# Altium schematic sheet OMODRI_Support.SchDoc
size A3; Date: Not shown in title block; ApprovedBy: Not shown in title block; CheckedBy: Not shown in title block; Author: Not shown in title block; CompanyName: Not shown in title block; DrawnBy: Cody Watkins; Engineer: Not shown in title block; Organization: Not shown in title block; Address1: Not shown in title block; Address2: Not shown in title block; Address3: Not shown in title block; Address4: Not shown in title block; DocumentNumber: 3; Revision: Use project parameter SCH_Rev; SheetNumber: 3; SheetTotal: 11; PageSetup: Record=PageOptions|CenterHorizontal=True|CenterVertical=True|PrintScale=1.00|XCorrection=1.00|YCorrection=1.00|PrintKind=0|BorderSize=5000000|LeftOffset=0|BottomOffset=0|Orientation=2|PaperLength=1000|PaperWidth=1000|Scale=100|PaperSource=15|PrintQuality=600|MediaType=1|DitherType=10|PaperKind=Letter|PrintScaleMode=1; CurrentTime: Not shown in title block; CurrentDate: Not shown in title block; Time: Not shown in title block; DocumentFullPathAndName: Not shown in title block; DocumentName: Not shown in title block; ModifiedDate: Not shown in title block; ImagePath: Not shown in title block
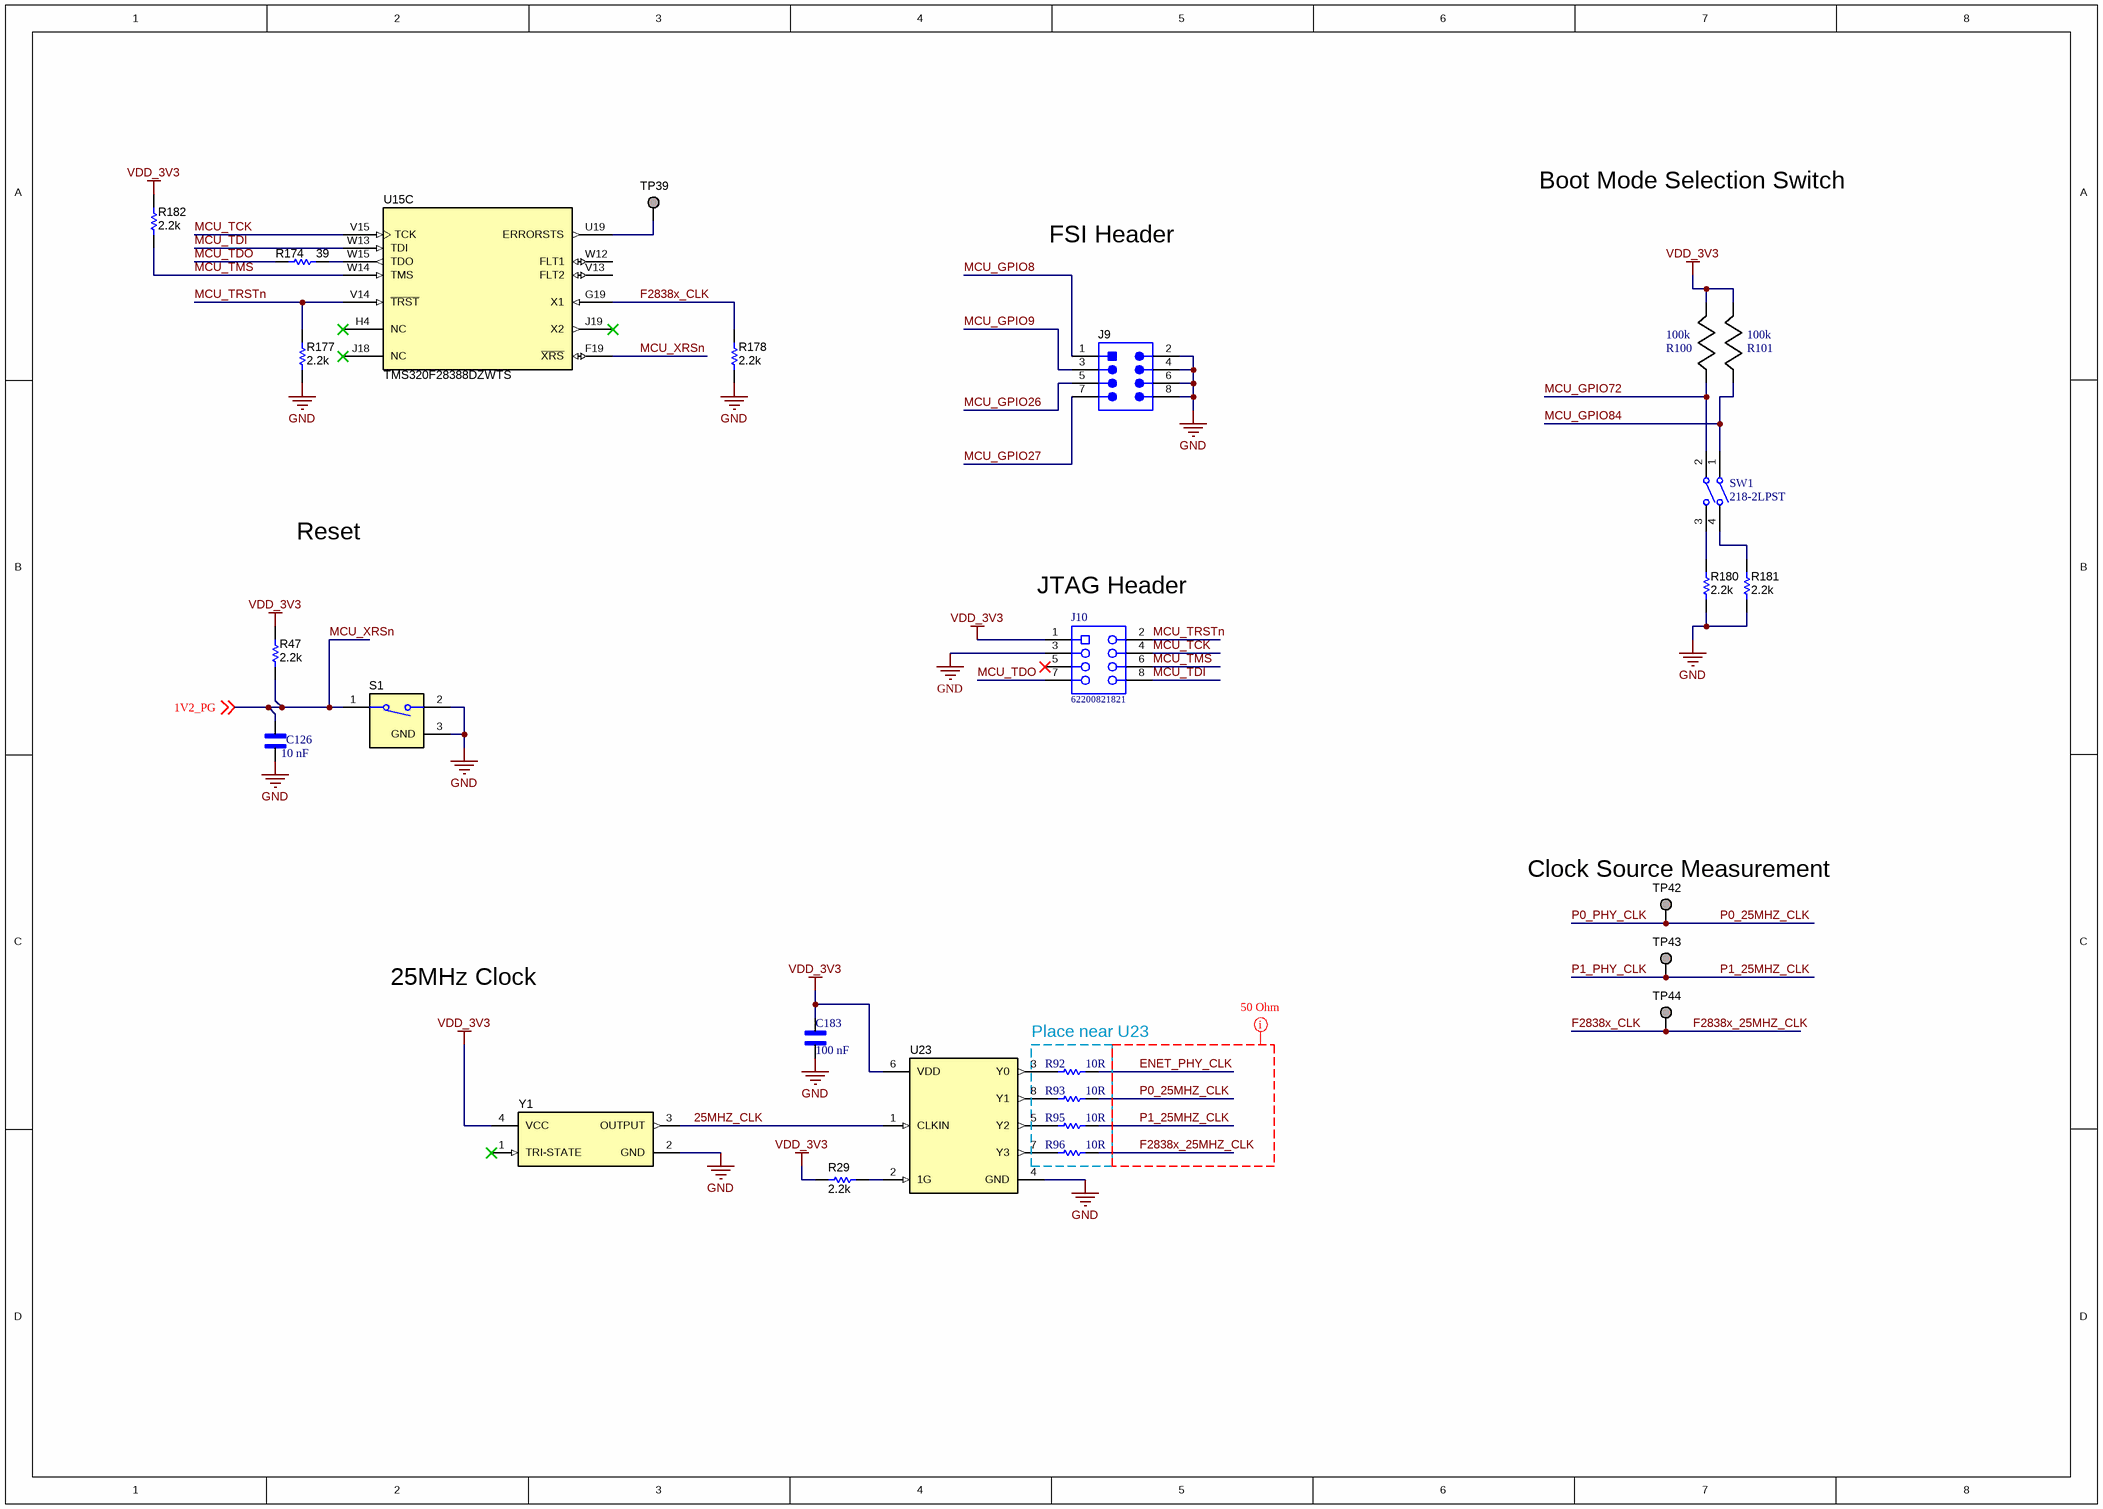
[diagram p0: OMODRI_Support.SchDoc]

## Parts
C126  value 10 nF  [CAPC0603X33N]  (hidden comment: GRM033R71E103KE14D)
C183  value 100 nF  [CAPC0603X33N]  (hidden comment: GRM033R61E104KE14D)
J9  TMM-104-01-T-D  [Samtec_TMM-104-01-x-D]  (value not drawn)
J10  62200821821  [62200821821]
R29  ValueDisplayed: 2.2k  [0402]  (hidden comment: CRCW04022K20JNED)
R47  ValueDisplayed: 2.2k  [0402]  (hidden comment: CRCW04022K20JNED)
R92  Resistance: 10R  [RESC1005X40X25ML05T10]  (hidden comment: CRCW040210R0FKEDHP)
R93  Resistance: 10R  [RESC1005X40X25ML05T10]  (hidden comment: CRCW040210R0FKEDHP)
R95  Resistance: 10R  [RESC1005X40X25ML05T10]  (hidden comment: CRCW040210R0FKEDHP)
R96  Resistance: 10R  [RESC1005X40X25ML05T10]  (hidden comment: CRCW040210R0FKEDHP)
R100  Resistance: 100k  [0402]  (hidden comment: CRCW0402100KFKED)
R101  Resistance: 100k  [0402]  (hidden comment: CRCW0402100KFKED)
R174  ValueDisplayed: 39  [0402]  (hidden comment: CRCW040239R0JNED)
R177  ValueDisplayed: 2.2k  [0402]  (hidden comment: CRCW04022K20JNED)
R178  ValueDisplayed: 2.2k  [0402]  (hidden comment: CRCW04022K20JNED)
R180  ValueDisplayed: 2.2k  [0402]  (hidden comment: CRCW04022K20JNED)
R181  ValueDisplayed: 2.2k  [0402]  (hidden comment: CRCW04022K20JNED)
R182  ValueDisplayed: 2.2k  [0402]  (hidden comment: CRCW04022K20JNED)
S1  B3U-1100P  [SW_B3U-1100P]  (value not drawn)
SW1  218-2LPST  [CTS-218-2LPST_V]
TP39  TESTPOINT  [TP_50MIL-25MILHOLE]  (value not drawn)  (no BOM)
TP42  TESTPOINT  [TP_50MIL-25MILHOLE]  (value not drawn)  (no BOM)
TP43  TESTPOINT  [TP_50MIL-25MILHOLE]  (value not drawn)  (no BOM)
TP44  TESTPOINT  [TP_50MIL-25MILHOLE]  (value not drawn)  (no BOM)
U15  TMS320F28388DZWTS  [ZWT0337A]  (part C of 5)
U23  CDCLVC1104PW  [PW0008A_N]  (value not drawn)
Y1  ECS-2520S33-250-FN-TR  [ECS_ECS-2520S]  (value not drawn)

## Nets
GND: C126.1 C183.2 J9.2 J9.4 J9.6 J9.8 J10.3 R177.1 R178.1 R180.2 R181.1 S1.2 S1.3(GND) U23.4(GND) Y1.2(GND)
VDD_3V3: C183.1 J10.1 R29.2 R47.2 R100.1 R101.1 R182.2 U23.6(VDD) Y1.4(VCC)
25MHZ_CLK: U23.1(CLKIN) Y1.3(OUTPUT)
ENET_PHY_CLK: R92.2
F2838x_25MHZ_CLK: R96.2 R178.2 TP44.1 U15.G19(X1)  [also labelled F2838x_CLK]
MCU_GPIO8: J9.1
MCU_GPIO9: J9.3
MCU_GPIO26: J9.5
MCU_GPIO27: J9.7
MCU_GPIO72: R100.2 SW1.2
MCU_GPIO84: R101.2 SW1.1
MCU_TCK: J10.4 U15.V15(TCK)
MCU_TDI: J10.8 U15.W13(TDI)
MCU_TDO: J10.7 R174.1
MCU_TMS: J10.6 R182.1 U15.W14(TMS)
MCU_TRSTn: J10.2 R177.2 U15.V14(~{TRST})
MCU_XRSn: C126.2 R47.1 S1.1 U15.F19(~{XRS}) ; off-sheet 1V2_PG  [also labelled 1V2_PG]
P0_25MHZ_CLK: R93.2 TP42.1  [also labelled P0_PHY_CLK]
P1_25MHZ_CLK: R95.2 TP43.1  [also labelled P1_PHY_CLK]
NetR29_1: R29.1 U23.2(1G)
NetR92_1: R92.1 U23.3(Y0)
NetR93_1: R93.1 U23.8(Y1)
NetR95_1: R95.1 U23.5(Y2)
NetR96_1: R96.1 U23.7(Y3)
NetR174_2: R174.2 U15.W15(TDO)
NetR180_1: R180.1 SW1.3
NetR181_2: R181.2 SW1.4
NetTP39_1: TP39.1 U15.U19(ERRORSTS)

Not connected (* = marked no-connect by the designer): J10 5*; U15 H4(NC)* J18(NC)* J19(X2)* V13(FLT2) W12(FLT1); Y1 1(TRI-STATE)*

## Layout directives
50 Ohm Impedance: Undefined: ENET_PHY_CLK, F2838x_25MHZ_CLK, P0_25MHZ_CLK, P1_25MHZ_CLK

## Notes on the sheet
- Boot Mode Selection Switch
- FSI Header
- Reset
- (near J10) JTAG Header
- (near TP42) Clock Source Measurement
- 25MHz Clock
- Place near U23
- Drawn By:
- SVN Rev:
- Number:
- TID #:
- Orderable:
- Rev:
- Sheet Title:
- File:
- Project Title:
- Designed for:
- Assembly Variant:
- Mod. Date:
- Sheet:
- Size:
- of
- B
- http://www.ti.com
- Texas Instruments and/or its licensors do not warrant the accuracy or completeness of this specification or any information contained therein. Texas Instruments and/or its licensors do not warrant that this design will meet the specifications, will be suitable for your application or fit for any particular purpose, or will operate in an implementation. Texas Instruments and/or its licensors do not warrant that the design is production worthy. You should completely validate and test your design implementation to confirm the system functionality for your application.
- Engineer:
- Contact:
- © Texas Instruments

## Library data of the parts
C126 = GRM033R71E103KE14D: SMD Capacitor X7R_EIA_ with Capacitance: 10000pF Tol. 10%. Rated Voltage: 25Vdc; MF: Murata; SnapEDA_Link: https://www.snapeda.com/parts/GRM033R71E103KE14D/Murata/view-part/4379447/?ref=snap; Package: 0603 Taiyo Yuden; MP: GRM033R71E103KE14D; Digi-Key_Purchase_URL: https://www.digikey.com/product-detail/en/murata-electronics/GRM033R71E103KE14D/490-14454-1-ND/6606915?utm_source=snapeda&utm_medium=aggregator&utm_campaign=symbol; Digi-Key_Part_Number: 490-14454-1-ND
C183 = GRM033R61E104KE14D: SMD Capacitor X5R_EIA_ with Capacitance: 0.10uF Tol. 10%. Rated Voltage: 25Vdc; MF: Murata; SnapEDA_Link: https://www.snapeda.com/parts/GRM033R61E104KE14D/Murata/view-part/4375622/?ref=snap; Availability: Unavailable; MP: GRM033R61E104KE14D; Package: 0603 Taiyo Yuden; Price: None
J9 = CMP-0055568-2: Header, 2mm, 4x2, Tin, TH; Manufacturer: Samtec; Current_A: 3.2A; Shrouded: N; Gender: Male; Cert_CSA: Y; Row_Count: 2; ComponentLink1URL: http://suddendocs.samtec.com/catalog_english/tmm_th.pdf; ClassName: Header; Supplier Part Number 2: 12P0661; Supplier 2: Newark; Supplier Part Number 3: 1803386; Color: Black; Supplier 3: Farnell; RoHS: Y; MountType: TH; Supplier 1: Digi-Key; PackageReference: Header, 2mm, 4x2, TH; PinCount: 8; CompType: Header; PartNumber: TMM-104-01-T-D; Orientation: Vertical; RowSpacing_mm: 2; ComponentLink1Description: Datasheet URL; Supplier Part Number 1: SAM1177-04-ND; Pitch_mm: 2; ContactFinish: Tin; Cert_UL: Y
J10 = CMP-1502-01180-1: THT Vertical Socket Header WR-PHD, Pitch 1.27 mm, Dual Row, 8 pins; Manufacturer: Wurth Elektronik; Withstanding Voltage: 500VAC; Working Voltage: 250VAC; Contact Resistance: 20mOhm; Gender: Female; Pitch: 1.27mm; Rated Current: 1A; Pin Number: 8; Part Number: 62200821821; Row Number: Dual; Package Reference: 62200821821; Mounting Technology: THT; Packaging: Tube; Manufacturer URL: http://www.we-online.de; Publisher: WurthElektronik; Orientation: Vertical; Operating Temperature: -40to105degC; Datasheet URL: https://katalog.we-online.de/em/datasheet/62200821821.pdf
R29 R47 R177 R178 R182 = CMP-0026890-5: RES, 2.2 k, 5%, 0.063 W, AEC-Q200 Grade 0, 0402; Manufacturer: Vishay-Dale; Power_W: 63mW; TempCo: 200 ppm/C; Value_Code: 2k20; Value: 2.2k; EIA_Code: E24; SizeX_mm: 1; SizeY_mm: 0.5; SizeZ_mm: 0.6; Value2: 0.063W; AEC Qualified: Y; VDC_V: 50V; AEC Category: Q200; AEC Grade: 0; Supplier Part Number 2: 59M6710; Supplier 2: Newark; Supplier Part Number 3: 71-CRCW0402J-2.2K-E3; Supplier 3: Mouser; RoHS: E; Value1: 5%; MountType: SMT; Supplier 1: Digi-Key; PackageReference: 0402; Tolerance_%: 5%; Res_ohm: 2.2k; SizeArea_mm2: 0.5; CompType: Resistor; PartNumber: CRCW04022K20JNED; ComponentLink1Description: Datasheet link; Supplier Part Number 1: 541-2.2KJCT-ND; Technology: Thick Film; ComponentLink1URL: http://www.vishay.com/docs/20035/dcrcwe3.pdf
R92 R93 R95 R96 = CRCW040210R0FKEDHP: SMD Chip Resistor, 0402 [1005 Metric], 10 ohm, CRCW-HP e3 Series, 50 V, Thick Film, 200 mW; Manufacturer: Vishay Dale; Voltage Rating (DC): 50V; Temperature Coefficient: 100ppm/°C; Tolerance: 1%; Power Rating: 125mW; Part Number: CRCW040210R0FKEDHP; Supplier 1: Digi-Key; Manufacturer Part Number: CRCW040210R0FKEDHP; RoHS: Yes; Category: Chip SMD Resistors; Stock 1: 25822; Pricing 1: 1=0,14000, 10=0,12600, 100=0,04840, 1000=0,02130, 2500=0,01839, 5000=0,01646 (USD); Mount: Surface Mount; Case/Package: 0402; Weight: 2.3E-05oz; Contact Plating: Tin; Case Code (Imperial): 0402; Case Code (Metric): 1005; Min Operating Temperature: -55°C; Max Operating Temperature: 155°C; Packaging: Tape and Reel; Voltage Rating: 50V; Package Quantity: 10000; Termination: SMD/SMT; Composition: Thick Film; Military Standard: Not; Length: 1mm; Height: 0.3mm; Width: 0.5mm; Depth: 0.5mm; Radiation Hardening: No; Lead Free: Lead Free; REACH SVHC: Unknown; ComponentLink1URL: https://datasheet.ciiva.com/5542/crcwhpe3-46056-5542142.pdf?src-supplier=Mouser; ComponentLink1Description: https://datasheet.ciiva.com/5542/crcwhpe3-46056-5542142.pdf?src-supplier=Mouser; Supplier Part Number 1: 541-10.0YCT-ND
R100 R101 = CRCW0402100KFKED: Res Thick Film 0402 100K Ohm 1% 1/16W 100ppm/C Molded SMD Paper T/R; Manufacturer: Vishay; Vendor: Vishay-Dale; Temperature Coefficient: 100ppm/°C; Power Rating: 63mW; Voltage Rating: 50V; Manufacturer_Part_Number: CRCW0402100KFKED; Manufacturer_Name: Vishay-Dale; RefDes: RefDes; TYPE: TYPE; Value: Value; Supplier 1: Farnell; Manufacturer Part Number: CRCW0402100KFKED; RoHS: Yes; Category: Chip SMD Resistors; Stock 1: 6820000; Pricing 1: 10000=0,00330 (EUR); Mount: Surface Mount; Case/Package: 0402; Number of Pins: 2; Weight: 2.3E-05oz; Contact Plating: Tin; Case Code (Metric): 1005; Case Code (Imperial): 0402; Min Operating Temperature: -55°C; Max Operating Temperature: 155°C; Tolerance: 1%; Composition: Thick Film; Termination: SMD/SMT; Number of Terminations: 2; Features: Automotive AEC-Q200; Max Power Dissipation: 63mW; Packaging: Tape and Reel; Package Quantity: 10000; Voltage Rating (DC): 50V; Military Standard: Not; Length: 1mm; Height: 0.35mm; Depth: 0.5mm; Width: 0.02inch; Radiation Hardening: No; Lead Free: Lead Free; REACH SVHC: Unknown; ComponentLink1URL: https://datasheet.ciiva.com/11810/0900766b80d98824-11810752.pdf?src-supplier=RSComponents; ComponentLink1Description: https://datasheet.ciiva.com/11810/0900766b80d98824-11810752.pdf?src-supplier=RSComponents; ComponentLink2URL: https://datasheet.ciiva.com/2463/dcrcwe3-2463064.pdf?src-supplier=Digi-Key; ComponentLink2Description: https://datasheet.ciiva.com/2463/dcrcwe3-2463064.pdf?src-supplier=Digi-Key; ComponentLink3URL: https://datasheet.ciiva.com/2463/dcrcwe3-2463065.pdf?src-supplier=Digi-Key; ComponentLink3Description: https://datasheet.ciiva.com/2463/dcrcwe3-2463065.pdf?src-supplier=Digi-Key; ComponentLink4URL: https://datasheet.ciiva.com/2463/dcrcwe3-2463066.pdf?src-supplier=Digi-Key; ComponentLink4Description: https://datasheet.ciiva.com/2463/dcrcwe3-2463066.pdf?src-supplier=Digi-Key; ComponentLink5URL: https://datasheet.ciiva.com/3255/dcrcwe3-3255948.pdf?src-supplier=Avnet; ComponentLink5Description: https://datasheet.ciiva.com/3255/dcrcwe3-3255948.pdf?src-supplier=Avnet; ComponentLink6URL: https://datasheet.ciiva.com/5546/dcrcwe3-109170-5546638.pdf?src-supplier=Mouser; ComponentLink6Description: https://datasheet.ciiva.com/5546/dcrcwe3-109170-5546638.pdf?src-supplier=Mouser; ComponentLink7URL: https://datasheet.ciiva.com/26316/fld-crcw-e3-data-en-26316630.pdf?src-supplier=Distrelec; ComponentLink7Description: https://datasheet.ciiva.com/26316/fld-crcw-e3-data-en-26316630.pdf?src-supplier=Distrelec; ComponentLink8URL: https://datasheet.ciiva.com/16776/70201119-16776281.pdf?src-supplier=Allied+Electronics; ComponentLink8Description: https://datasheet.ciiva.com/16776/70201119-16776281.pdf?src-supplier=Allied+Electronics; ComponentLink9URL: https://datasheet.ciiva.com/16941/dcrcwe3-16941129.pdf?src-supplier=Avnet+Europe; ComponentLink9Description: https://datasheet.ciiva.com/16941/dcrcwe3-16941129.pdf?src-supplier=Avnet+Europe; ComponentLink10URL: https://datasheet.ciiva.com/3255/dcrcwe3-3255947.pdf?src-supplier=Avnet; ComponentLink10Description: https://datasheet.ciiva.com/3255/dcrcwe3-3255947.pdf?src-supplier=Avnet; ComponentLink11URL: https://datasheet.ciiva.com/16208/dcrcwe3-16208508.pdf?src-supplier=Future+Electronics; ComponentLink11Description: https://datasheet.ciiva.com/16208/dcrcwe3-16208508.pdf?src-supplier=Future+Electronics; ComponentLink12URL: https://datasheet.ciiva.com/46441/1720486-46441598.pdf?src-supplier=Element14; ComponentLink12Description: https://datasheet.ciiva.com/46441/1720486-46441598.pdf?src-supplier=Element14; Supplier Part Number 1: 2121857
R174 = CMP-0026916-3: RES, 39, 5%, 0.063 W, AEC-Q200 Grade 0, 0402; Manufacturer: Vishay-Dale; Power_W: 63mW; TempCo: 200 ppm/C; Value_Code: 39R0; Value: 39; EIA_Code: E24; SizeX_mm: 1; SizeY_mm: 0.5; SizeZ_mm: 0.6; Value2: 0.063W; AEC Qualified: Y; VDC_V: 50V; AEC Category: Q200; AEC Grade: 0; Supplier Part Number 2: 89M6649; Supplier 2: Newark; Supplier Part Number 3: 71-CRCW0402J-39-E3; Supplier 3: Mouser; RoHS: E; Value1: 5%; MountType: SMT; Supplier 1: Digi-Key; PackageReference: 0402; Tolerance_%: 5%; Res_ohm: 39; SizeArea_mm2: 0.5; CompType: Resistor; PartNumber: CRCW040239R0JNED; ComponentLink1Description: Datasheet link; Supplier Part Number 1: 541-39JCT-ND; Technology: Thick Film; ComponentLink1URL: http://www.vishay.com/docs/20035/dcrcwe3.pdf
R180 R181 = CMP-0026890-5: RES, 2.2 k, 5%, 0.063 W, AEC-Q200 Grade 0, 0402; Manufacturer: Vishay-Dale; Value: 2.2k; Value_Code: 2k20; Power_W: 63mW; Value2: 0.063W; VDC_V: 50V; TempCo: 200 ppm/C; EIA_Code: E24; AEC Category: Q200; AEC Qualified: Y; AEC Grade: 0; SizeArea_mm2: 0.5; SizeX_mm: 1; SizeZ_mm: 0.6; CompType: Resistor; PartNumber: CRCW04022K20JNED; PackageReference: 0402; RoHS: E; Res_ohm: 2.2k; Tolerance_%: 5%; Value1: 5%; MountType: SMT; Technology: Thick Film; ComponentLink1Description: Datasheet link; ComponentLink1URL: http://www.vishay.com/docs/20035/dcrcwe3.pdf; Supplier 1: Digi-Key; Supplier Part Number 1: 541-2.2KJCT-ND; Supplier 2: Newark; Supplier Part Number 2: 59M6710; Supplier 3: Mouser; Supplier Part Number 3: 71-CRCW0402J-2.2K-E3; SizeY_mm: 0.5
S1 = CMP-0002193-2: Switch, SPST-NO, Off-Mom, 12 V, SMD; Manufacturer: Omron Electronic Components; CurrentRating_mA: 50A; PositionCount: 1; VDC_V: 12V; Supplier 2: Newark; Supplier 3: Mouser; Supplier 1: Digi-Key; Supplier Part Number 1: SW1021CT-ND; Supplier Part Number 2: 39M4619; Supplier Part Number 3: 653-B3U-1100P; PartNumber: B3U-1100P; ComponentLink1Description: Datasheet URL; LatestRevisionDate: 2017-03-09; CompType: Switch; Publisher: Texas Instruments; Circuit: SPST-NO; RoHS: Y; Orientation: Top Actuated; SwitchFunction: Off-Mom; PackageReference: SMD, 3-Leads, Body 3x2.5mm; MountType: SMT; ComponentLink1URL: http://www.omron.com/ecb/products/pdf/en-b3u.pdf
SW1 = CMP-2000-05530-1: Half Pitch DIP Switch Auto Placeable, 25 mA, 24 V, -55 to 85 degC, 4-Pin SMD, RoHS, Tube; Manufacturer: CTS Corporation; Voltage Rating: 24VDC; Number of Positions: 2; Online Catalog: 218Series; Actuator Type: Slide(Standard); Washable: Yes; Pitch: 0.050"(1.27mm),Half; 3D Model: 218Series2Pole.stp; Catalog Drawings: 218-2218SeriesFootprint218SeriesEnd; Other Names: 2182LPSTCT2182LPST; Electrical Life: 1,000Cycles; Current Rating: 25mA; Actuator Level: Flush,Recessed; Circuit: SPST; Package Reference: 218-2LPST; Contact Finish: Gold; Product Training Modules: DIPSwitch; Mounting Technology: SurfaceMount; Datasheet URL: http://www.ctscorp.com/wp-content/uploads/2015/11/218.pdf; Height Above Board: 0.104"(2.65mm); Operating Temperature: -55°C~85°C; Family: DIPSwitches; Package Description: 4-Pin Surface Mount Device, Body 5.8 x 3.71 mm, Pitch 1.27 mm; Packaging: Tube; Category: Switches; Features: EpoxySealedTerminals,TapeSeal; Series: 218; Mounting Type: SurfaceMount; Mechanical Life: -; Termination Style: GullWing; Length: 0.146"(3.71mm); Body Material: -; Standard Package: 145; Contact Material: BerylliumCopper; Manufacturer URL: http://www.ctscorp.com/; Datasheet Version: 12/2008
TP39 TP42-TP44 = CMP-0078143-2: TEST POINT.  No entry in BOM.; CompType: Testpoint; PackageReference: N/A; Manufacturer: N/A; PartNumber: N/A; Library Reference: TESTPOINT
U15 = CMP-0081777-3: TMS320F28388DZWTS, ZWT0337A (NFBGA-337); Manufacturer: Texas Instruments; SizeAreaWB_mm2: 324; SizeArea_mm2: 256; AEC Qualified: N; AEC Category: Q200; SizeZ_mm: 1.4; SizeY_mm: 16; CompType: IC; ComponentLink1Description: Datasheet Link; ComponentLink2Description: Product Folder; PackageReference: ZWT0337A; PartNumber: TMS320F28388DZWTS; PackageDescription: NFBGA-337; ComponentLink2URL: http://www.ti.com/product/tms320f28388d; Alternate Manufacturer: Texas Instruments; ComponentLink3URL: http://www.ti.com/product/tms320f28388d/datasheet; ComponentLink1URL: http://www.ti.com/lit/ds/symlink/tms320f28388d.pdf; MountType: SMT; ComponentLink3Description: Online Datasheet; SizeX_mm: 16
U23 = CMP-0065661-1: Low Jitter, 1:4 LVCMOS Fan-out Clock Buffer, PW0008A (TSSOP-8); Alternate Manufacturer: Texas Instruments; Green_Lifecycle: Active; SizeAreaWB_mm2: 42.0; Green_REACh: Passed; U/M: EA; SizeZ_mm: 1.2; SizeX_mm: 6.4; SizeY_mm: 3.0; SizeArea_mm2: 19.2; CompType: IC; ComponentLink1URL: http://www.ti.com/lit/ds/symlink/cdclvc1104.pdf; Publisher: Texas Instruments; PackageDescription: TSSOP-8; RoHS: Y; Footprint Path 6: C:\AltiumLibraries\Footprints\TI\.PcbLib; MountType: SMT; Green_EU RoHS-2: Passed; Manufacturer: Texas Instruments; Green_EU RoHS: Passed; PackageReference: PW0008A; LatestRevisionDate: 2017-06-09; PartNumber: CDCLVC1104PW; ComponentLink1Description: Datasheet Link
Y1 = CMP-0082061-1: Oscillator, 25 MHz, 15 pF, SMD; Manufacturer: ECS Inc.; Frequency Stability: 10 ppm; SizeAreaWB_mm2: 10.5; SizeArea_mm2: 5; AEC Qualified: N; AEC Category: Q200; TaMax_C: 85°C; SizeZ_mm: 1; Frequency_Fixed: 25MHz; TaMin_C: -40°C; SizeY_mm: 2.5; Load Capacitance: 15 pF; SizeX_mm: 2; ComponentLink1Description: Datasheet Link; RoHS: Y; Supplier 1: Digi-Key; PackageReference: 2x2.5mm; PartNumber: ECS-2520S33-250-FN-TR; Supplier Part Number 2: 520-2520S33-250-FNT; Supplier 2: Mouser; AEC Grade: N/A; ComponentLink1URL: https://www.ecsxtal.com/store/pdf/ECS-2520S.pdf; CompType: Oscillator; Supplier Part Number 1: XC2198CT-ND; MountType: SMT